# EAGLE schematic ArmazConnect - Rev B1 (EAGLE 7.5.0)
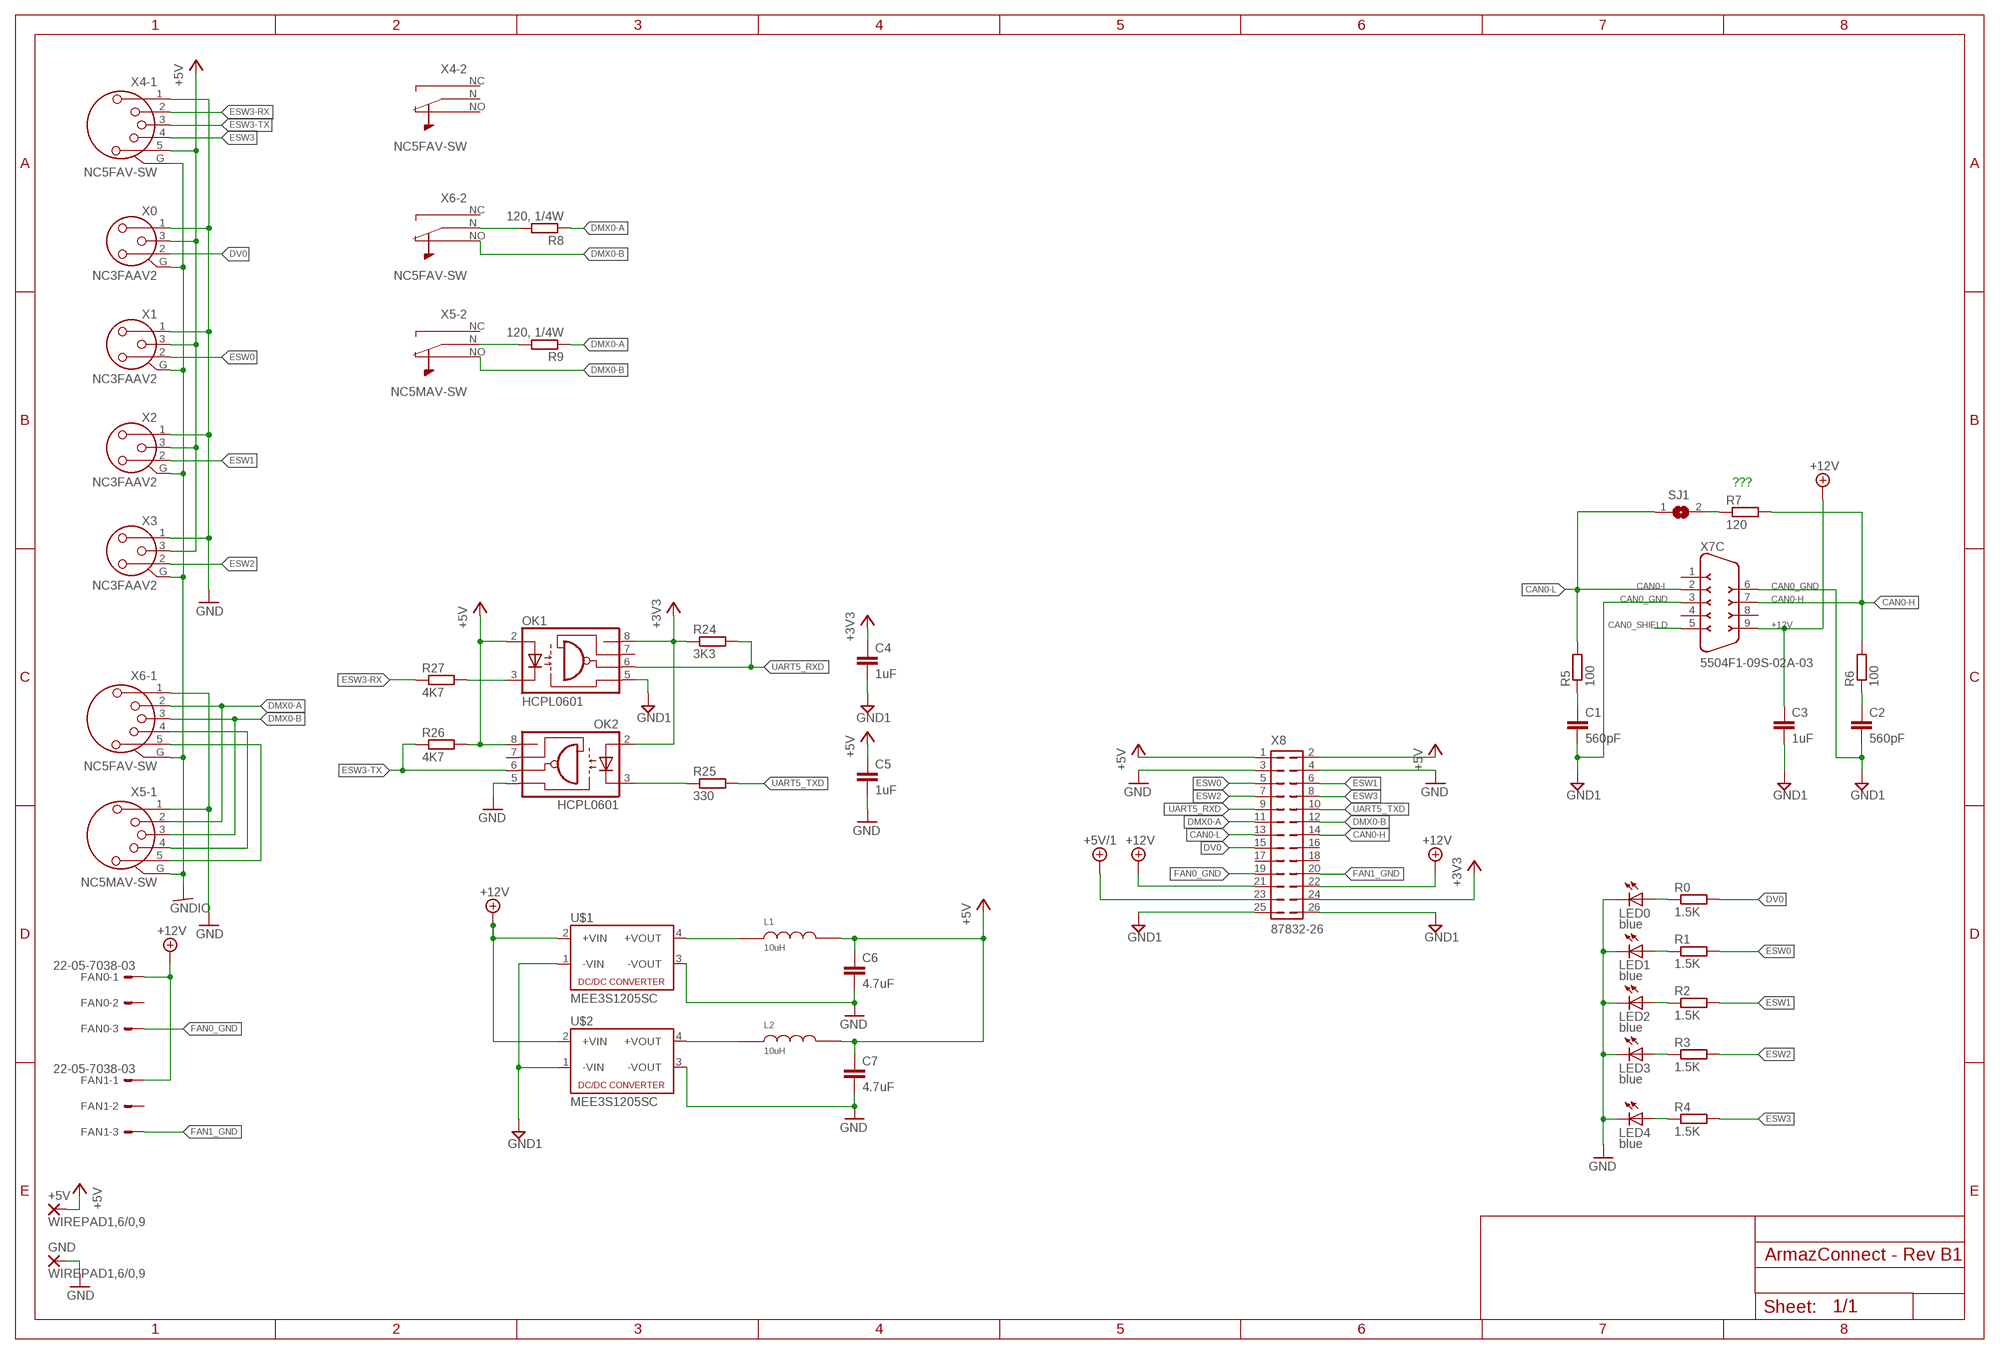
[diagram p0: schematic, sheet 1]

## Parts
+5V  WIREPAD1,6/0,9  [1,6/0,9]
C1  560pF  C-EUC0603  [C0603]
C2  560pF  C-EUC0603  [C0603]
C3  1uF  C-EUC0603  [C0603]
C4  1uF  C-EUC0805  [C0805]
C5  1uF  C-EUC0805  [C0805]
C6  4.7uF  C-EUC0603  [C0603]
C7  4.7uF  C-EUC0603  [C0603]
FAN0  22-05-7038-03  [7395-03]
FAN1  22-05-7038-03  [7395-03]
GND  WIREPAD1,6/0,9  [1,6/0,9]
L1  10uH  84103C  [8200]
L2  10uH  84103C  [8200]
LED0  blue  LEDCHIP-LED0603  [CHIP-LED0603]
LED1  blue  LEDCHIP-LED0603  [CHIP-LED0603]
LED2  blue  LEDCHIP-LED0603  [CHIP-LED0603]
LED3  blue  LEDCHIP-LED0603  [CHIP-LED0603]
LED4  blue  LEDCHIP-LED0603  [CHIP-LED0603]
OK1  HCPL0601  [SOIC08]
OK2  HCPL0601  [SOIC08]
R0  1.5K  R-EU_R0603  [R0603]
R1  1.5K  R-EU_R0603  [R0603]
R2  1.5K  R-EU_R0603  [R0603]
R3  1.5K  R-EU_R0603  [R0603]
R4  1.5K  R-EU_R0603  [R0603]
R5  100  R-EU_R0603  [R0603]
R6  100  R-EU_R0603  [R0603]
R7  120  R-EU_R0603  [R0603]
R8  120, 1/4W  R-EU_R0603  [R0603]
R9  120, 1/4W  R-EU_R0603  [R0603]
R24  3K3  R-EU_R0402  [R0402]
R25  330  R-EU_R0603  [R0603]
R26  4K7  R-EU_R0603  [R0603]
R27  4K7  R-EU_R0603  [R0603]
SJ1  SJ  [SJ]
U$1  MEE3S1205SC  [MEE3]
U$2  MEE3S1205SC  [MEE3]
X0  NC3FAAV2  [NC3FAV2]
X1  NC3FAAV2  [NC3FAV2]
X2  NC3FAAV2  [NC3FAV2]
X3  NC3FAAV2  [NC3FAV2]
X4  NC5FAV-SW  [NC5FAV-SW]
X5  NC5MAV-SW  [NC5MAV-SW]
X6  NC5FAV-SW  [NC5FAV-SW]
X7  5504F1-09S-02A-03  [5504F1-09S-02A]
X8  87832-26  [87832-26]

## Nets
+3V3: C4.1 OK1.8(VCC) OK2.2(A) R24.1 X8.24
+5V [supply]: +5V.1(P) C5.1 C6.1 C7.1 L1.2 L2.2 OK1.2(A) OK2.8(VCC) R26.2 X0.3 X1.3 X2.3 X3.3 X4.5 X8.1 X8.2
+5V/1 [supply]: X8.23
+12V [supply]: C3.1 FAN0.1 FAN1.1 U$1.2(+VIN) U$2.2(+VIN) X7.9 X8.21 X8.22
CAN0-H: R6.2 R7.2 X7.7 X8.14
CAN0-L: R5.2 SJ1.1 X7.2 X8.13
CAN0_GND: C1.2 C2.2 X7.3 X7.6 ; supply symbol labelled GND1
CAN0_SHIELD: X7.5
DMX0-A: R8.1 R9.1 X5.2 X6.2 X8.11
DMX0-B: X5.3 X5.NO(-2:NO) X6.3 X6.NO(-2:NO) X8.12
DV0: R0.2 X0.2 X8.15
ESW0: R1.2 X1.2 X8.5
ESW1: R2.2 X2.2 X8.6
ESW2: R3.2 X3.2 X8.7
ESW3: R4.2 X4.4 X8.8
ESW3-RX: R27.1 X4.2
ESW3-TX: OK2.6(VO) R26.1 X4.3
FAN0_GND [supply]: FAN0.3 X8.19
FAN1_GND [supply]: FAN1.3 X8.20
GND [supply]: C5.2 C6.2 C7.2 GND.1(P) LED0.C LED1.C LED2.C LED3.C LED4.C OK2.5(GND) U$1.3(-VOUT) U$2.3(-VOUT) X0.1 X1.1 X2.1 X3.1 X4.1 X5.1 X6.1 X8.3 X8.4
GND1 [supply]: C3.2 C4.2 OK1.5(GND) U$1.1(-VIN) U$2.1(-VIN) X8.25 X8.26
GNDIO: X0.G X1.G X2.G X3.G X4.G(-1:G) X5.G(-1:G) X6.G(-1:G)
N$1: LED1.A R1.1
N$2: LED2.A R2.1
N$3: LED3.A R3.1
N$4: LED4.A R4.1
N$5: C1.1 R5.1
N$6: C2.1 R6.1
N$7: R7.1 SJ1.2
N$8: R8.2 X6.N(-2:N)
N$9: L1.1 U$1.4(+VOUT)
N$10: L2.1 U$2.4(+VOUT)
N$15: R9.2 X5.N(-2:N)
N$16: LED0.A R0.1
N$17: OK2.3(C) R25.1
N$20: OK1.3(C) R27.2
N$27: X5.4 X6.4
N$28: X5.5 X6.5
UART5_RXD: OK1.6(VO) R24.2 X8.9
UART5_TXD: R25.2 X8.10
Unconnected: FAN0.2 FAN1.2 OK1.7(VE) OK2.7(VE) X4.N(-2:N) X4.NC(-2:NC) X4.NO(-2:NO) X5.NC(-2:NC) X6.NC(-2:NC) X7.1 X7.4 X7.8 X7.G1(S:SHIELD) X7.G2(S:SHIELD) X8.16 X8.17 X8.18

## Notes on the sheet
- ???

## Library data of the parts
+5V GND = wirepad:WIREPAD: Wire PAD connect wire on PCB; OC_FARNELL: unknown
C1 C2 = rcl:C-EU: CAPACITOR, European symbol; MF: MULTICOMP; MPN: MC0805B561K500CT; OC_FARNELL: 1759219
C3-C5 = rcl:C-EU: CAPACITOR, European symbol; MF: MULTICOMP; MPN: MC0805F105Z250CT; OC_FARNELL: 1759429
C6 C7 = rcl:C-EU: CAPACITOR, European symbol
FAN0 FAN1 = con-molex:22-?-03: CONNECTOR wire to board 2.54 mm (.1 inch) pitch header; MF: MOLEX; MPN: 22-05-7038; OC_FARNELL: 9731610; OC_NEWARK: unknown
L1 L2 = murata-inductance:84103C
LED0 LED1-LED4 = led:LED: LED OSRAM: - CHIPLED LG R971, LG N971, LY N971, LG Q971, LY Q971, LO R971, LY R971 LH N974, LH R974 LS Q976, LO Q976, LY Q976 LO Q996 - Hyper CHIPLED LW Q18S LB Q993, LB Q99A, LB R99A - SideLED LS A670, LO A670, LY A670, LG A670, LP A670 LB A673, LV A673, LT A673, LW A673 LH A674 LY A675 LS A676, LA A676, LO A676, LY A676, LW A676 LS A679, LY A679, LG A679 - Hyper Micro SIDELED® LS Y876, LA Y876, LO Y876, LY Y876 LT Y87S - SmartLED LW L88C, LW L88S LB L89C, LB L89S, LG L890 LS L89K, LO L89K, LY L89K LS L896, LA L896, LO L896, LY L896 - TOPLED LS T670, LO T670, LY T670, LG T670, LP T670 LSG T670, LSP T670, LSY T670, LOP T670, LYG T670 LG T671, LOG T671, LSG T671 LB T673, LV T673, LT T673, LW T673 LH T674 LS T676, LA T676, LO T676, LY T676, LB T676, LH T676, LSB T676, LW T676 LB T67C, LV T67C, LT T67C, LS T67K, LO T67K, LY T67K, LW E67C LS E67B, LA E67B, LO E67B, LY E67B, LB E67C, LV E67C, LT E67C LW T67C LS T679, LY T679, LG T679 LS T770, LO T770, LY T770, LG T770, LP T770 LB T773, LV T773, LT T773, LW T773 LH T774 LS E675, LA E675, LY E675, LS T675 LS T776, LA T776, LO T776, LY T776, LB T776 LHGB T686 LT T68C, LB T68C - Hyper Mini TOPLED® LB M676 - Mini TOPLED Santana® LG M470 LS M47K, LO M47K, LY M47K Source: http://www.osram.convergy.de LUXEON: - LUMILED® LXK2-PW12-R00, LXK2-PW12-S00, LXK2-PW14-U00, LXK2-PW14-V00 LXK2-PM12-R00, LXK2-PM12-S00, LXK2-PM14-U00 LXK2-PE12-Q00, LXK2-PE12-R00, LXK2-PE12-S00, LXK2-PE14-T00, LXK2-PE14-U00 LXK2-PB12-K00, LXK2-PB12-L00, LXK2-PB12-M00, LXK2-PB14-N00, LXK2-PB14-P00, LXK2-PB14-Q00 LXK2-PR12-L00, LXK2-PR12-M00, LXK2-PR14-Q00, LXK2-PR14-R00 LXK2-PD12-Q00, LXK2-PD12-R00, LXK2-PD12-S00 LXK2-PH12-R00, LXK2-PH12-S00 LXK2-PL12-P00, LXK2-PL12-Q00, LXK2-PL12-R00 Source: www.luxeon.com KINGBRIGHT: KA-3528ASYC Source: www.kingbright.com; MF: MULTICOMP; MPN: OVS-0603; OC_FARNELL: 1716770
OK1 OK2 = optocoupler:HCPL0601: HEWLETT PACKARD OPTO COUPLER; MF: AVAGO TECHNOLOGIES; MPN: HCPL-0601-000E; OC_FARNELL: 9995102; OC_NEWARK: 88H7776
R0 R1-R4 = rcl:R-EU_: RESISTOR, European symbol; MF: MULTICOMP; MPN: MCMR04X1501FTL; OC_FARNELL: 2072645
R5 R6 = rcl:R-EU_: RESISTOR, European symbol; MF: MULTICOMP; MPN: MC00625W04021100R; OC_FARNELL: 1358015
R7 = rcl:R-EU_: RESISTOR, European symbol; MF: MULTICOMP; MPN: MC00625W04021120R; OC_FARNELL: 1358018
R8 R9 = rcl:R-EU_: RESISTOR, European symbol; MF: MULTICOMP; MPN: MCHP05W4F1200T5E; OC_FARNELL: 1576447
R24 = rcl:R-EU_: RESISTOR, European symbol; MF: MULTICOMP; MPN: MC00625W040213K3; OC_FARNELL: 1358056
R25 = rcl:R-EU_: RESISTOR, European symbol; MF: MULTICOMP; MPN: MC00625W04021330R; OC_FARNELL: 1358028
R26 R27 = rcl:R-EU_: RESISTOR, European symbol; MF: MULTICOMP; MPN: MC00625W040214K7; OC_FARNELL: 1358060
SJ1 = jumper:SJ: SMD solder JUMPER; OC_FARNELL: unknown
U$1 U$2 = dc-dc-converter:MEE3
X0 X1-X3 = con-neutrik_ag:NC3: Neutrik Audio Connector XLR SERIES Stereo 1/4" jack Source: www.neutrik.com/; MF: NEUTRIK; MPN: NC3FAAV2; OC_FARNELL: 1310038
X4 X6 = con-neutrik_ag:NC5?-SW: Neutrik Audio Connector XLR SERIES Stereo 1/4" jack Source: www.neutrik.com/; MF: NEUTRIK; MPN: NC5FAV-SW; OC_FARNELL: 1310093
X5 = con-neutrik_ag:NC5?-SW: Neutrik Audio Connector XLR SERIES Stereo 1/4" jack Source: www.neutrik.com/; MF: NEUTRIK; MPN: NC5MAV-SW; OC_FARNELL: 1310098
X7 = con-multicomp:5504F1-09S-02A-03; MF: MULTICOMP; MPN: 5504F1-09S-02A-03; OC_FARNELL: 1848372
X8 = con-molex:87832-26: Milli-Grid Header 2.00mm (.079") Pitch; MF: MOLEX; MPN: 87832-2620; OC_FARNELL: 2313712; OC_NEWARK: unknown

## Net classes
0 default: width 0.152 mm, drill 0.25 mm, clearance 0.205 mm
1 supply: width 0.406 mm, drill 0.35 mm, clearance 0.205 mm to class 0, clearance 0.205 mm
2 supply2: width 0.203 mm, drill 0.25 mm, clearance 0.205 mm to class 0, clearance 0.205 mm to class 1, clearance 0.205 mm